# EAGLE design stm32_core_0_1 (EAGLE 5.10)
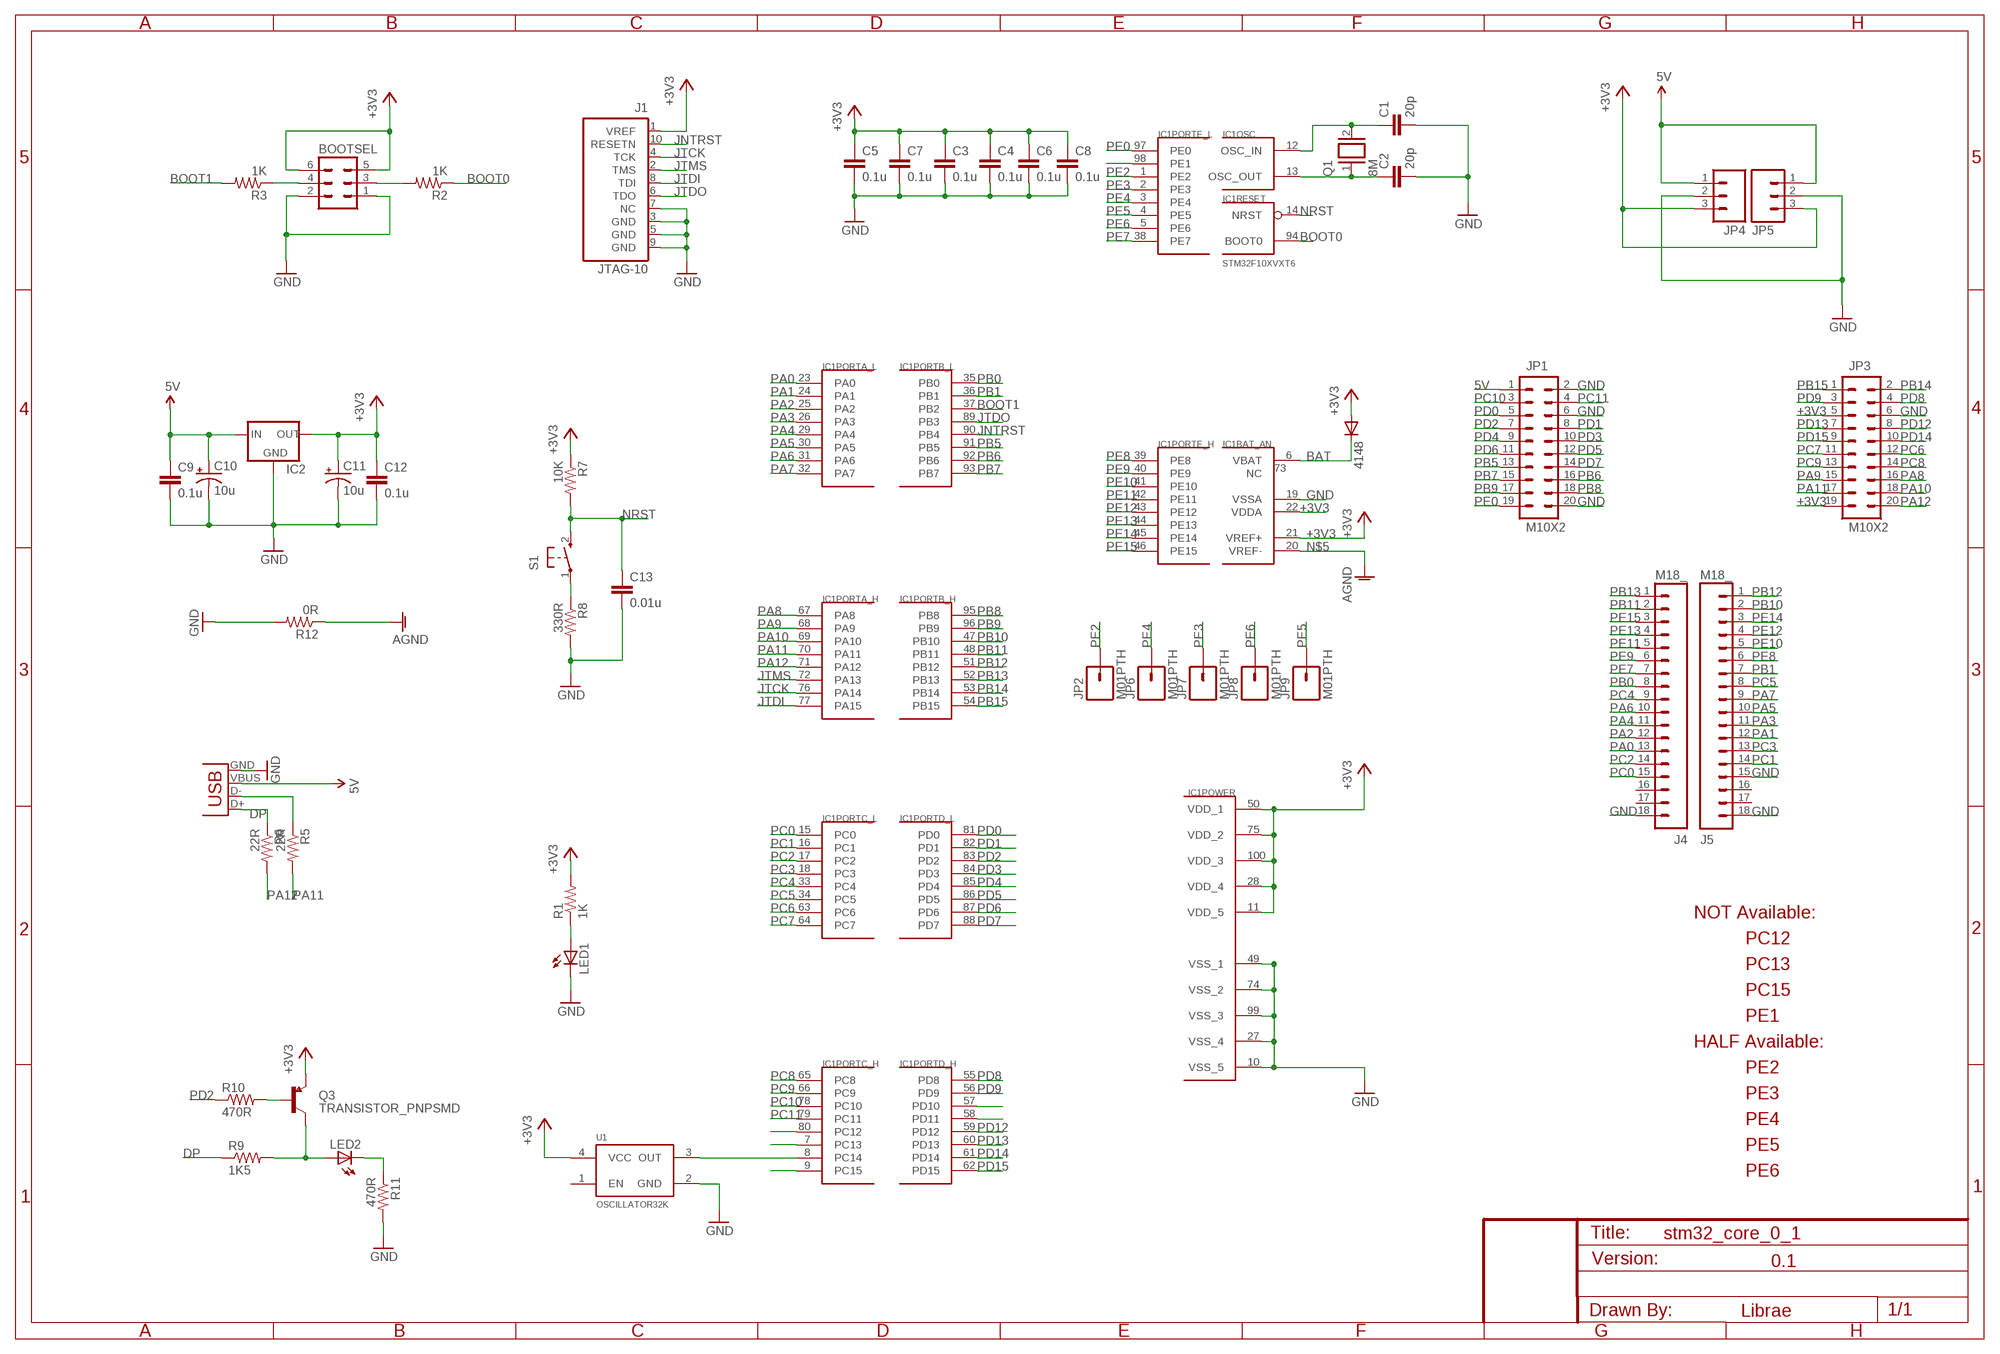
[diagram p0: schematic, sheet 1]

## Parts
4148  DIODESMA  [SMA-DIODE]
BOOTSEL  MA03-2  [MA03-2]
C1  20p  CAP0603-CAP  [0603-CAP]
C2  20p  CAP0603-CAP  [0603-CAP]
C3  0.1u  CAP0603-CAP  [0603-CAP]
C4  0.1u  CAP0603-CAP  [0603-CAP]
C5  0.1u  CAP0603-CAP  [0603-CAP]
C6  0.1u  CAP0603-CAP  [0603-CAP]
C7  0.1u  CAP0603-CAP  [0603-CAP]
C8  0.1u  CAP0603-CAP  [0603-CAP]
C9  0.1u  CAP0603-CAP  [0603-CAP]
C10  10u  CAP_POL3528  [EIA3528]
C11  10u  CAP_POL3528  [EIA3528]
C12  0.1u  CAP0603-CAP  [0603-CAP]
C13  0.01u  CAP0603-CAP  [0603-CAP]
IC1  STM32F10XVXT6  [TQFP100]
IC2  V_REG_LM1117SOT223  [SOT223]
J1  JTAG-10  [JTAG-10]
J4  M18_  [1X18]
J5  M18_  [1X18]
JP1  M10X2  [2X10]
JP2  M01PTH  [1X01]
JP3  M10X2  [2X10]
JP4  M03PTH  [1X03]
JP5  M03PTH  [1X03]
JP6  M01PTH  [1X01]
JP7  M01PTH  [1X01]
JP8  M01PTH  [1X01]
JP9  M01PTH  [1X01]
LED1  LED0603  [LED-0603]
LED2  LED0603  [LED-0603]
Q1  8M  XTAL/S  [QS]
Q3  TRANSISTOR_PNPSMD  [SOT23-3]
R1  1K  RESISTOR0603-RES  [0603-RES]
R2  1K  RESISTOR0603-RES  [0603-RES]
R3  1K  RESISTOR0603-RES  [0603-RES]
R5  22R  RESISTOR0603-RES  [0603-RES]
R6  22R  RESISTOR0603-RES  [0603-RES]
R7  10K  RESISTOR0603-RES  [0603-RES]
R8  330R  RESISTOR0603-RES  [0603-RES]
R9  1K5  RESISTOR0603-RES  [0603-RES]
R10  470R  RESISTOR0603-RES  [0603-RES]
R11  470R  RESISTOR0603-RES  [0603-RES]
R12  0R  RESISTOR0603-RES  [0603-RES]
S1  TAC_SWITCH  [TACTILE-PTH]
U1  OSCILLATOR32K  OSCILLATOR5X3  [CRYSTAL-SMD-5X3]
X2  USBSMD  [USB-MINIB]

## Nets
5V: C9.1 C10.A(+) IC2.3(IN) JP1.1 JP4.1 JP5.1 X2.VBUS
+3V3: 4148.A BOOTSEL.5 BOOTSEL.6 C3.1 C4.1 C5.1 C6.1 C7.1 C8.1 C11.A(+) C12.1 IC1.11(POWER:VDD_5) IC1.21(BAT_AN:VREF+) IC1.22(BAT_AN:VDDA) IC1.28(POWER:VDD_4) IC1.50(POWER:VDD_1) IC1.75(POWER:VDD_2) IC1.100(POWER:VDD_3) IC2.2(OUT) J1.1(VREF) JP3.5 JP3.19 JP4.3 JP5.3 Q3.2(E) R1.2 R7.1 U1.4(VCC)
BAT: 4148.C IC1.6(BAT_AN:VBAT)
BOOT0: IC1.94(RESET:BOOT0) R2.1
BOOT1: IC1.37(PORTB_L:PB2) R3.2
DP: R6.1 R9.1 X2.D+
GND: BOOTSEL.1 BOOTSEL.2 C1.2 C2.2 C3.2 C4.2 C5.2 C6.2 C7.2 C8.2 C9.2 C10.C(-) C11.C(-) C12.2 C13.2 IC1.10(POWER:VSS_5) IC1.19(BAT_AN:VSSA) IC1.27(POWER:VSS_4) IC1.49(POWER:VSS_1) IC1.74(POWER:VSS_2) IC1.99(POWER:VSS_3) IC2.1(ADJ) J1.3(GND) J1.5(GND) J1.7(NC) J1.9(GND) J4.18 J5.15 J5.18 JP1.2 JP1.6 JP1.20 JP3.6 JP4.2 JP5.2 LED1.C R8.2 R11.2 R12.2 U1.2(GND) X2.GND
JNTRST: IC1.90(PORTB_L:PB4) J1.10(RESETN)
JTCK: IC1.76(PORTA_H:PA14) J1.4(TCK)
JTDI: IC1.77(PORTA_H:PA15) J1.8(TDI)
JTDO: IC1.89(PORTB_L:PB3) J1.6(TDO)
JTMS: IC1.72(PORTA_H:PA13) J1.2(TMS)
N$1: C1.1 IC1.12(OSC:OSC_IN) Q1.2
N$2: IC1.57(PORTD_H:PD10)
N$3: C2.1 IC1.13(OSC:OSC_OUT) Q1.1
N$4: LED1.A R1.1
N$5: IC1.20(BAT_AN:VREF-) R12.1 ; supply symbol labelled AGND
N$6: BOOTSEL.4 R3.1
N$8: BOOTSEL.3 R2.2
N$9: R5.1 X2.D-
N$10: LED2.C R11.1
N$11: R8.1 S1.1
N$12: LED2.A Q3.3(C) R9.2
N$13: Q3.1(B) R10.2
N$14: IC1.7(PORTC_H:PC13)
N$15: IC1.8(PORTC_H:PC14) U1.3(OUT)
N$16: IC1.9(PORTC_H:PC15)
N$17: IC1.58(PORTD_H:PD11)
N$18: IC1.80(PORTC_H:PC12)
N$24: IC1.98(PORTE_L:PE1)
NRST: C13.1 IC1.14(RESET:NRST) R7.2 S1.2
PA0: IC1.23(PORTA_L:PA0) J4.13
PA1: IC1.24(PORTA_L:PA1) J5.12
PA2: IC1.25(PORTA_L:PA2) J4.12
PA3: IC1.26(PORTA_L:PA3) J5.11
PA4: IC1.29(PORTA_L:PA4) J4.11
PA5: IC1.30(PORTA_L:PA5) J5.10
PA6: IC1.31(PORTA_L:PA6) J4.10
PA7: IC1.32(PORTA_L:PA7) J5.9
PA8: IC1.67(PORTA_H:PA8) JP3.16
PA9: IC1.68(PORTA_H:PA9) JP3.15
PA10: IC1.69(PORTA_H:PA10) JP3.18
PA11: IC1.70(PORTA_H:PA11) JP3.17 R5.2
PA12: IC1.71(PORTA_H:PA12) JP3.20 R6.2
PB0: IC1.35(PORTB_L:PB0) J4.8
PB1: IC1.36(PORTB_L:PB1) J5.7
PB5: IC1.91(PORTB_L:PB5) JP1.13
PB6: IC1.92(PORTB_L:PB6) JP1.16
PB7: IC1.93(PORTB_L:PB7) JP1.15
PB8: IC1.95(PORTB_H:PB8) JP1.18
PB9: IC1.96(PORTB_H:PB9) JP1.17
PB10: IC1.47(PORTB_H:PB10) J5.2
PB11: IC1.48(PORTB_H:PB11) J4.2
PB12: IC1.51(PORTB_H:PB12) J5.1
PB13: IC1.52(PORTB_H:PB13) J4.1
PB14: IC1.53(PORTB_H:PB14) JP3.2
PB15: IC1.54(PORTB_H:PB15) JP3.1
PC0: IC1.15(PORTC_L:PC0) J4.15
PC1: IC1.16(PORTC_L:PC1) J5.14
PC2: IC1.17(PORTC_L:PC2) J4.14
PC3: IC1.18(PORTC_L:PC3) J5.13
PC4: IC1.33(PORTC_L:PC4) J4.9
PC5: IC1.34(PORTC_L:PC5) J5.8
PC6: IC1.63(PORTC_L:PC6) JP3.12
PC7: IC1.64(PORTC_L:PC7) JP3.11
PC8: IC1.65(PORTC_H:PC8) JP3.14
PC9: IC1.66(PORTC_H:PC9) JP3.13
PC10: IC1.78(PORTC_H:PC10) JP1.3
PC11: IC1.79(PORTC_H:PC11) JP1.4
PD0: IC1.81(PORTD_L:PD0) JP1.5
PD1: IC1.82(PORTD_L:PD1) JP1.8
PD2: IC1.83(PORTD_L:PD2) JP1.7 R10.1
PD3: IC1.84(PORTD_L:PD3) JP1.10
PD4: IC1.85(PORTD_L:PD4) JP1.9
PD5: IC1.86(PORTD_L:PD5) JP1.12
PD6: IC1.87(PORTD_L:PD6) JP1.11
PD7: IC1.88(PORTD_L:PD7) JP1.14
PD8: IC1.55(PORTD_H:PD8) JP3.4
PD9: IC1.56(PORTD_H:PD9) JP3.3
PD12: IC1.59(PORTD_H:PD12) JP3.8
PD13: IC1.60(PORTD_H:PD13) JP3.7
PD14: IC1.61(PORTD_H:PD14) JP3.10
PD15: IC1.62(PORTD_H:PD15) JP3.9
PE0: IC1.97(PORTE_L:PE0) JP1.19
PE2: IC1.1(PORTE_L:PE2) JP2.1
PE3: IC1.2(PORTE_L:PE3) JP7.1
PE4: IC1.3(PORTE_L:PE4) JP6.1
PE5: IC1.4(PORTE_L:PE5) JP9.1
PE6: IC1.5(PORTE_L:PE6) JP8.1
PE7: IC1.38(PORTE_L:PE7) J4.7
PE8: IC1.39(PORTE_H:PE8) J5.6
PE9: IC1.40(PORTE_H:PE9) J4.6
PE10: IC1.41(PORTE_H:PE10) J5.5
PE11: IC1.42(PORTE_H:PE11) J4.5
PE12: IC1.43(PORTE_H:PE12) J5.4
PE13: IC1.44(PORTE_H:PE13) J4.4
PE14: IC1.45(PORTE_H:PE14) J5.3
PE15: IC1.46(PORTE_H:PE15) J4.3
Unconnected: IC1.73(BAT_AN:NC) J4.16 J4.17 J5.16 J5.17 U1.1(EN)

## Notes on the sheet
- NOT Available:
- PC12
- PC13
- PC15
- PE1
- HALF Available:
- PE2
- PE3
- PE4
- PE5
- PE6
- 0.1

## Library data of the parts
4148 = MyLib:DIODE: Diode These are standard reverse protection diodes and small signal diodes. SMA package can handle up to about 1A. SOD-323 can handle about 200mA. What the SOD-323 package when ordering, there are some mfgs out there that are 5-pin packages.
BOOTSEL = con-lstb:MA03-2: PIN HEADER
C1-C9 C12 C13 = SparkFun:CAP: Capacitor Standard 0603 ceramic capacitor, and 0.1" leaded capacitor.
C10 C11 = SparkFun:CAP_POL: Capacitor Polarized These are standard SMD and PTH capacitors. Normally 10uF, 47uF, and 100uF in electrolytic and tantalum varieties. Always verify the external diameter of the through hole cap, it varies with capacity, voltage, and manufacturer. The EIA devices should be standard.
IC1 = stm32:STM32F10XVXT6: STM32F101/103 100 pin LQFP
IC2 = MyLib:V_REG_LM1117: Voltage Regulator LM1117 Standard adjustable voltage regulator but in SMD form. Spark Fun Electronics SKU : COM-00595
J1 = luminary-arm:JTAG-10: JTAG 10-Pin Programming/Debug Connector
J4 J5 = MyLib:M18
JP1 JP3 = MyLib:M10X2: This was SPECIALLY designed to be used with our Graphic LCD Backpack. Be sure you want to use this! It is not only staggered on each line of header holes, but IT IS ALSO offset of the center point of the top and bottom lines by 5 mil. This causes the headers to lock into place on the "standard" footprint on the LCD screen. The extra squares on the tdocu layer are there simply to reference other pins (if you were to actually populate a longer header than ten long - this is what we do with the backpacks).
JP2 JP6-JP9 = MyLib:M01: Header 1 Standard 1-pin 0.1" header. Use with straight break away headers (SKU : PRT-00116), right angle break away headers (PRT-00553), swiss pins (PRT-00743), machine pins (PRT-00117), and female headers (PRT-00115).
JP4 JP5 = MyLib:M03: Header 3 Standard 3-pin 0.1" header. Use with straight break away headers (SKU : PRT-00116), right angle break away headers (PRT-00553), swiss pins (PRT-00743), machine pins (PRT-00117), and female headers (PRT-00115). Molex polarized connector foot print use with SKU : PRT-08232 with associated crimp pins and housings.
LED1 LED2 = SparkFun:LED: LEDs Standard schematic elements and footprints for 5mm, 3mm, 1206, and 0603 sized LEDs. 5mm - Spark Fun Electronics SKU : COM-00529 (and others)
Q1 = special:XTAL/S: CRYSTAL
Q3 = SparkFun:TRANSISTOR_PNP
R1-R3 R5-R12 = SparkFun:RESISTOR: Resistor Basic schematic elements and footprints for 0603, 1206, and PTH 1/10th watt (small) resistors.
S1 = MyLib:TAC_SWITCH: Momentary Switch Button commonly used for reset or general input. Spark Fun Electronics SKU : COM-00097
U1 = SparkFun:OSCILLATOR
X2 = SparkFun:USB: USB Connectors USB-B-PTH is fully proven SKU : PRT-00139 USB-miniB is fully proven SKU : PRT-00587 USB-A-PCB is untested. USB-A-H is throughly reviewed, but untested. Spark Fun Electronics SKU : PRT-00437 USB-B-SMT is throughly reviewed, but untested. Needs silkscreen touching up. USB-A-S has not been used/tested USB-MB-H has not been used/tested

## Board
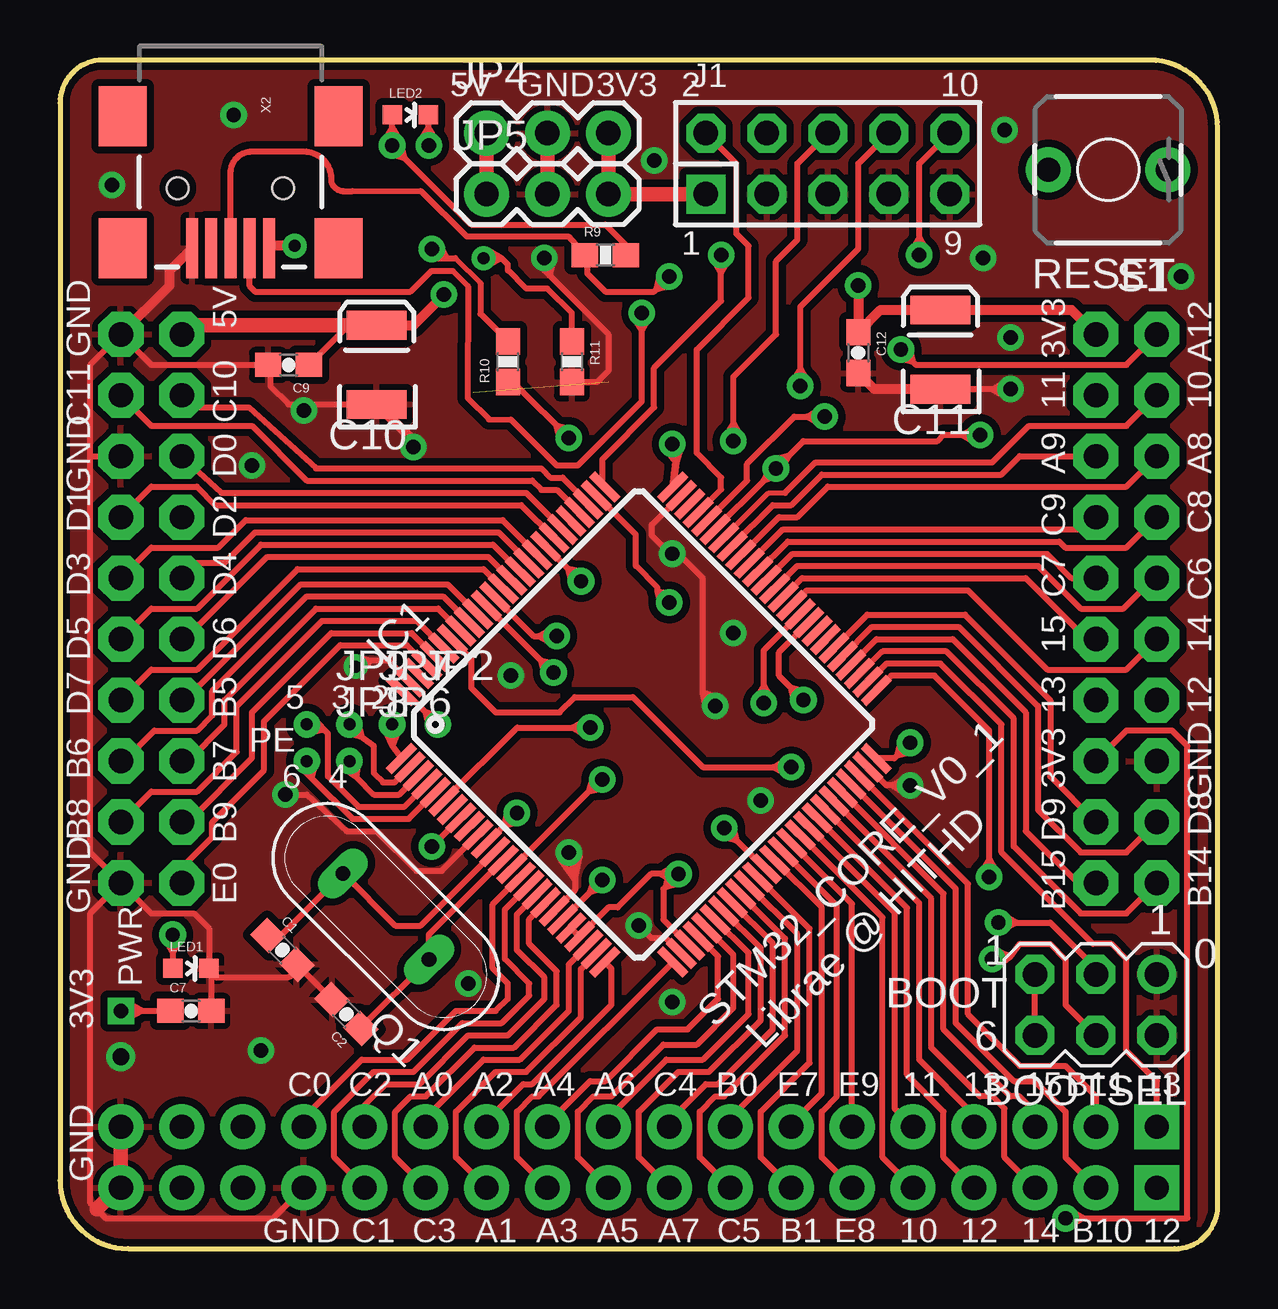
[diagram p1: board, top side]
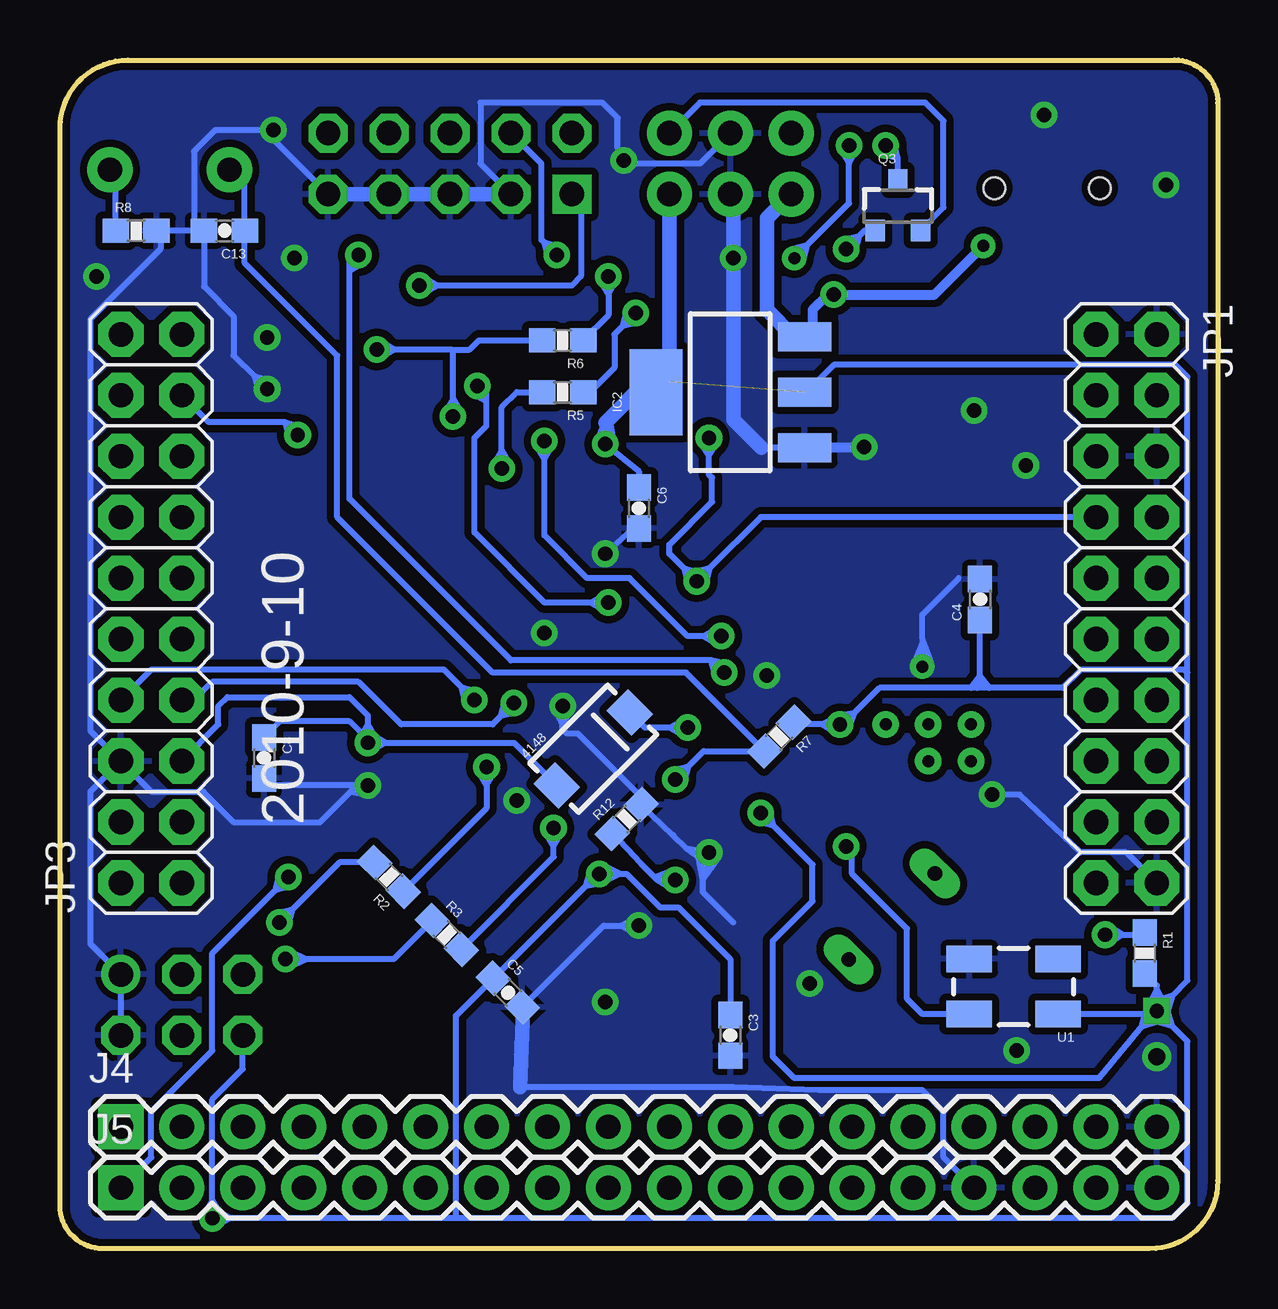
[diagram p2: board, bottom side, seen from below]

Size 48.26 x 49.53 mm. Coordinates in mm from the lower left corner, seen from the top.
Outline: 0,2.84 arc90 2.84,0 46.46,0 arc90 48.26,1.8 48.26,46.69 arc90 45.42,49.53 1.8,49.53 arc90 0,47.73 0,2.84
Copper layers (1*16): Top 0.035mm / dielectric 1.5mm / Bottom 0.035mm
Design rules "SparkFun": minimum track width 8mil, minimum drill 20mil, track to track 8mil, track to pad 8mil, pad to pad 8mil, via to via 8mil, smd to smd 8mil, copper to edge 10mil, drill to drill 8mil, minimum pad ring 12mil, minimum via ring 10mil, stop-mask expansion 4mil, vias tented up to drill 25mil, thermal gap 10mil

### Footprints (pad centres in the part's own frame; a part is rotated, then mirrored left to right if it is on the bottom)
SMA-DIODE = smd 1.27 x 1.47: A -2.15,0; C 2.15,0
MA03-2 = drill 1.016 round: 1 -2.54,-1.27 | drill 1.016 octagon: 2 -2.54,1.27; 3 0,-1.27; 4 0,1.27; 5 2.54,-1.27; 6 2.54,1.27
0603-CAP = smd 1.1 x 1: 1 -0.85,0; 2 0.85,0
EIA3528 = smd 1.2 x 2.5: A 1.65,0; C -1.65,0
TQFP100 = smd 1.5 x 0.35: 1 -8,6; 2 -8,5.5; 3 -8,5; 4 -8,4.5; 5 -8,4; 6 -8,3.5; 7 -8,3; 8 -8,2.5; 9 -8,2; 10 -8,1.5; 11 -8,1; 12 -8,0.5; 13 -8,0; 14 -8,-0.5; 15 -8,-1; 16 -8,-1.5; 17 -8,-2; 18 -8,-2.5; 19 -8,-3; 20 -8,-3.5; 21 -8,-4; 22 -8,-4.5; 23 -8,-5; 24 -8,-5.5; 25 -8,-6; 51 8,-6; 52 8,-5.5; 53 8,-5; 54 8,-4.5; 55 8,-4; 56 8,-3.5; 57 8,-3; 58 8,-2.5; 59 8,-2; 60 8,-1.5; 61 8,-1; 62 8,-0.5; 63 8,0; 64 8,0.5; 65 8,1; 66 8,1.5; 67 8,2; 68 8,2.5; 69 8,3; 70 8,3.5; 71 8,4; 72 8,4.5; 73 8,5; 74 8,5.5; 75 8,6 | smd 0.35 x 1.5: 26 -6,-8; 27 -5.5,-8; 28 -5,-8; 29 -4.5,-8; 30 -4,-8; 31 -3.5,-8; 32 -3,-8; 33 -2.5,-8; 34 -2,-8; 35 -1.5,-8; 36 -1,-8; 37 -0.5,-8; 38 0,-8; 39 0.5,-8; 40 1,-8; 41 1.5,-8; 42 2,-8; 43 2.5,-8; 44 3,-8; 45 3.5,-8; 46 4,-8; 47 4.5,-8; 48 5,-8; 49 5.5,-8; 50 6,-8; 76 6,8; 77 5.5,8; 78 5,8; 79 4.5,8; 80 4,8; 81 3.5,8; 82 3,8; 83 2.5,8; 84 2,8; 85 1.5,8; 86 1,8; 87 0.5,8; 88 0,8; 89 -0.5,8; 90 -1,8; 91 -1.5,8; 92 -2,8; 93 -2.5,8; 94 -3,8; 95 -3.5,8; 96 -4,8; 97 -4.5,8; 98 -5,8; 99 -5.5,8; 100 -6,8
SOT223 = smd 1.219 x 2.235: 1 -2.311,-3.099; 2 0,-3.099; 3 2.311,-3.099 | smd 3.6 x 2.2: 4 0,3.099
JTAG-10 = drill 1.016 square: 1 -5.08,-1.27 | drill 1.016 octagon: 2 -5.08,1.27; 3 -2.54,-1.27; 4 -2.54,1.27; 5 0,-1.27; 6 0,1.27; 7 2.54,-1.27; 8 2.54,1.27; 9 5.08,-1.27; 10 5.08,1.27
1X18 = drill 1.016 pad 1.88 square: 1 0,0 | drill 1.016 pad 1.88 round: 2 2.54,0; 3 5.08,0; 4 7.62,0; 5 10.16,0; 6 12.7,0; 7 15.24,0; 8 17.78,0; 9 20.32,0; 10 22.86,0; 11 25.4,0; 12 27.94,0; 13 30.48,0; 14 33.02,0; 15 35.56,0; 16 38.1,0; 17 40.64,0; 18 43.18,0
2X10 = drill 1.016 pad 1.88 octagon: 1 -11.43,-1.27; 2 -11.43,1.27; 3 -8.89,-1.27; 4 -8.89,1.27; 5 -6.35,-1.27; 6 -6.35,1.27; 7 -3.81,-1.27; 8 -3.81,1.27; 9 -1.27,-1.27; 10 -1.27,1.27; 11 1.27,-1.27; 12 1.27,1.27; 13 3.81,-1.27; 14 3.81,1.27; 15 6.35,-1.27; 16 6.35,1.27; 17 8.89,-1.27; 18 8.89,1.27; 19 11.43,-1.27; 20 11.43,1.27
1X01 = drill 0.5 pad 1.016 round: 1 0,0
1X03 = drill 1.016 pad 1.88 round: 1 0,0; 2 2.54,0; 3 5.08,0
LED-0603 = smd 0.8 x 0.8: A 0,-0.75; C 0,0.75
QS = drill 0.61 long: 1 -2.54,0; 2 2.54,0
SOT23-3 = smd 0.8 x 0.9: 1 -0.95,-1; 2 0.95,-1; 3 0,1.1
0603-RES = smd 1.1 x 1: 1 -0.85,0; 2 0.85,0
TACTILE-PTH = drill 1.016 pad 1.88 round: 1 -2.489,0; 2 2.489,0
CRYSTAL-SMD-5X3 = smd 1.9 x 1.1: 1 -1.85,-1.15; 2 1.85,-1.15; 3 1.85,1.15; 4 -1.85,1.15
USB-MINIB = smd 2.5 x 0.5: D+ 2.5,0; D- 2.5,0.8; GND 2.5,-1.6; ID 2.5,-0.8; VBUS 2.5,1.6 | smd 2.5 x 2: GND@1 -3,-4.5; GND@2 -3,4.5; GND@3 2.5,4.5; GND@4 2.5,-4.5 | hole 0.9: 0,2.2; 0,-2.2

### Placement (x,y rotation side)
4148  26.04,20.83 45 bottom
BOOTSEL  43.18,10.16 180 top
C1  9.27,12.45 315 top
C2  11.94,9.78 135 top
C3  20.32,8.89 270 bottom
C4  9.91,27.05 90 bottom
C5  29.59,10.67 315 bottom
C6  24.13,30.86 270 bottom
C7  5.46,9.91 0 top
C8  39.75,20.45 270 bottom
C9  9.53,36.83 180 top
C10  13.21,36.83 90 top
C11  36.7,37.47 90 top
C12  33.27,37.34 270 top
C13  41.4,42.42 180 bottom
IC1  24.13,21.84 45 top
IC2  20.32,35.69 90 bottom
J1  32,45.21 0 top
J4  45.72,5.08 0 bottom
J5  45.72,2.54 0 bottom
JP1  3.81,26.67 270 bottom
JP2  13.84,21.84 0 top
JP3  44.45,26.67 90 bottom
JP4  17.78,46.48 0 top
JP5  17.78,43.94 0 top
JP6  12.06,20.32 0 top
JP7  12.06,21.84 0 top
JP8  10.29,20.32 0 top
JP9  10.29,21.84 0 top
LED1  5.46,11.68 270 top
LED2  14.61,47.24 270 top
Q1  13.59,13.84 135 top
Q3  13.34,43.43 0 bottom
R1  3.05,12.32 270 bottom
R2  34.54,15.49 135 bottom
R3  32.13,13.08 315 bottom
R5  27.3,35.69 180 bottom
R6  27.3,37.85 180 bottom
R7  18.29,21.34 225 bottom
R8  45.09,42.42 0 bottom
R9  22.73,41.4 0 top
R10  18.67,36.96 90 top
R11  21.34,36.96 270 top
R12  24.64,17.91 45 bottom
S1  43.69,44.96 180 top
U1  8.51,10.92 180 bottom
X2  7.11,44.2 270 top

### Tracks (layer width: path | path; a pad name or v marks a point on that pad's centre or on a via)
5V  (via drill 0.5, 0.6)
  Top 0.254: C9.1 12.03,38.48 C10.A
  Top 0.406: C10.A 14.73,38.48 v16,39.75 | X2.VBUS 8.8,41.78 v9.78,41.78
  Top 0.61: JP5.1 JP4.1 | JP1.1 5.46,38.48 C10.A
  Bottom 0.254: 16.89,38.2 17.02,38.2 IC2.3 17.68,38
  Bottom 0.406: 16.89,38.2 16.89,39.12 16.26,39.75 v16,39.75 11.81,39.75 v9.78,41.78
  Bottom 0.61: JP5.1 18.8,42.93 18.8,39.12 17.68,38
+3V3  (via drill 0.6)  (1 unrouted)
  Top 0.254: v15.75,21.84 15.22,22.37 | 15.22,22.37 14.33,23.26 IC1.100 | IC1.50 34.78,20.43 34.9,20.55 | v35.43,21.08 34.9,20.55 | BOOTSEL.6 BOOTSEL.5 | JP3.5 44.45,21.59 46.35,21.59 46.99,20.95 46.99,1.27 42.66,1.27 | 26.67,12.32 26.67,12.19 26.25,12.61 IC1.28 26.21,12.65 25.15,13.72 25.15,14.99 25.25,15.09 | v25.78,15.62 25.25,15.09 | IC1.21 IC1.22 22.86,14.22 23.24,14.22 24.64,15.62 25.03,15.62 | v25.78,15.62 25.03,15.62 | IC1.11 17.78,16.89 18.52,17.63 | v19.05,18.16 18.52,17.63 | v2.54,9.91 3.44,9.91 | 3.44,9.91 C7.1 | v41.91,1.27 42.66,1.27 | 15.22,22.37 15.38,21.75 v15.75,21.84 | 15.22,22.37 15.84,22.21 v15.75,21.84 | 3.44,9.91 2.74,10.28 v2.54,9.91 | 3.44,9.91 2.74,9.53 v2.54,9.91 | 34.9,20.55 35.53,20.72 v35.43,21.08 | 34.9,20.55 35.07,21.18 v35.43,21.08 | 42.66,1.27 42.1,1.6 v41.91,1.27 | 42.66,1.27 42.1,0.94 v41.91,1.27 | 25.25,15.09 25.88,15.26 v25.78,15.62 | 25.25,15.09 25.42,15.72 v25.78,15.62 | 25.03,15.62 25.59,15.29 v25.78,15.62 | 25.03,15.62 25.59,15.95 v25.78,15.62 | 18.52,17.63 19.15,17.8 v19.05,18.16 | 18.52,17.63 18.68,18.26 v19.05,18.16
  Top 0.305: v25.53,33.53 25.67,33.38 25.67,32.79 | 25.67,32.79 IC1.75 | 25.67,32.79 25.86,33.43 v25.53,33.53 | 25.67,32.79 25.25,33.31 v25.53,33.53
  Top 0.406: JP3.19 42.16,39.12 C11.A 34.2,39.12 C12.1 v33.27,40.13
  Top 0.61: JP4.3 JP5.3 J1.1
  Bottom 0.254: Q3.2 11.43,43.39 11.43,46.99 12.19,47.75 21.59,47.75 JP4.3 | 25.4,34.79 25.53,34.42 v25.53,33.53 | R7.1 17.59,21.84 16.5,21.84 | 1.27,24 1.27,11.18 1.9,10.54 | 1.27,24 1.27,36.32 1.78,36.83 16,36.83 16.83,36.01 | v2.54,9.91 1.9,10.54 | v2.54,9.91 2.54,10.81 | 2.54,10.81 2.54,10.96 R1.2 | 4148.A 29.33,21.08 34.68,21.08 | v35.43,21.08 34.68,21.08 | 1.9,9.27 1.27,8.64 1.27,1.91 1.91,1.27 31.75,1.27 | 1.9,9.27 2.41,9.78 | 31.75,1.27 41.16,1.27 | 41.16,1.27 v41.91,1.27 | 31.75,1.27 31.75,9.71 C5.1 26.34,15.12 | 26.34,15.12 25.84,15.62 v25.78,15.62 | 18.52,17.63 16.89,16 16.89,14.48 18.54,12.83 18.54,8 17.65,7.11 4.95,7.11 4.46,7.7 3.18,9.27 | 18.52,17.63 v19.05,18.16 | v2.54,9.91 3.18,9.27 | 32.52,40.13 26.92,40.13 26.54,40.51 26.54,43.94 J1.1 | 32.52,40.13 v33.27,40.13 | 16.83,36.01 17.14,35.69 | BOOTSEL.6 40.64,7.49 41.91,6.22 41.91,2.02 | v41.91,1.27 41.91,2.02 | v15.75,21.84 16.5,21.84 | v15.75,21.84 15.62,21.84 15.16,22.31 | 15.16,22.31 14.1,23.37 10.29,23.37 | 9.53,23.37 6.48,23.37 5.71,24.13 1.4,24.13 1.27,24 | 9.53,23.37 10.03,23.37 | 10.03,23.37 10.29,23.37 | IC2.2 17.22,36.01 16.83,36.01 | 25.4,34.79 25.2,33.72 v25.53,33.53 | 25.4,34.79 25.85,33.72 v25.53,33.53 | 32.52,40.13 33.08,39.81 v33.27,40.13 | 32.52,40.13 33.08,40.46 v33.27,40.13 | 16.5,21.84 15.94,22.17 v15.75,21.84 | 16.5,21.84 15.94,21.52 v15.75,21.84 | 15.16,22.31 15.4,21.7 v15.75,21.84 | 15.16,22.31 15.8,22.22 v15.75,21.84 | 1.9,10.54 2.13,9.78 v2.54,9.91 | 1.9,10.54 2.66,10.31 v2.54,9.91 | 2.54,10.81 2.16,10.11 v2.54,9.91 | 2.54,10.81 2.92,10.11 v2.54,9.91 | 1.9,9.27 2.66,9.5 v2.54,9.91 | 1.9,9.27 2.13,10.03 v2.54,9.91 | 3.18,9.27 2.95,10.03 v2.54,9.91
  Bottom 0.254: 3.18,9.27 2.42,9.5 v2.54,9.91 | 34.68,21.08 35.24,20.76 v35.43,21.08 | 34.68,21.08 35.24,21.41 v35.43,21.08 | 41.16,1.27 41.72,0.94 v41.91,1.27 | 41.16,1.27 41.72,1.6 v41.91,1.27 | 41.91,2.02 41.58,1.46 v41.91,1.27 | 41.91,2.02 42.24,1.46 v41.91,1.27 | 26.34,15.12 26.14,15.74 v25.78,15.62 | 26.34,15.12 25.7,15.25 v25.78,15.62 | 18.52,17.63 19.15,17.8 v19.05,18.16 | 18.52,17.63 18.68,18.26 v19.05,18.16 | C3.1 20.32,12.06 22.48,14.22 23.24,14.22 24.64,15.62 24.89,15.62 | v25.78,15.62 24.89,15.62 | 24.89,15.62 25.65,16 v25.78,15.62 | v25.78,15.62 25.65,15.24 24.89,15.62 | 9.91,23.88 9.91,23.5 10.03,23.37 | 9.91,23.88 C4.1 | 9.53,23.37 9.91,23.88 | 9.91,23.88 10.29,23.37 | C6.1 24.13,32.38 v25.53,33.53 | JP3.5 41.66,21.84 41.66,22.61 41.27,22.99 36.2,22.99 35.43,22.23 35.43,21.84 | 35.43,21.84 v35.43,21.08 | 35.43,21.84 35.05,21.21 v35.43,21.08 | v35.43,21.08 35.81,21.21 35.43,21.84 | C8.1 39.08,21.97 36.2,21.97 35.43,21.21 v35.43,21.08 | U1.4 2.54,9.77 v2.54,9.91 | 22.86,36.12 23.82,36.12
  Bottom 0.61: JP5.3 22.86,36.12 | v25.53,33.53 25.45,33.53 | 23.82,36.12 25.53,34.42 | 2.41,9.78 v2.54,9.91
BAT  (via drill 0.6)
  Top 0.254: 21.35,21.72 v22.1,21.72 | 21.35,21.72 21.91,21.39 v22.1,21.72 | 21.35,21.72 21.91,22.04 v22.1,21.72 | IC1.6 19.05,21.72 21.35,21.72
  Bottom 0.254: 24.39,22.23 4148.C 23.88,21.72 22.85,21.72 | v22.1,21.72 22.85,21.72 | 22.85,21.72 22.29,22.04 v22.1,21.72 | 22.85,21.72 22.29,21.39 v22.1,21.72
BOOT0  (via drill 0.6)
  Top 0.254: 29.73,20.07 26.8,20.07 23.88,22.99 21.46,22.99 20.83,22.35 18.16,22.35 17.14,23.37 17.14,24.59 IC1.94 | 29.73,20.07 v30.48,20.07 | 29.73,20.07 30.29,19.74 v30.48,20.07 | 29.73,20.07 30.29,20.39 v30.48,20.07
  Bottom 0.254: v30.48,20.07 30.48,19.32 | 30.48,19.32 30.48,18.36 R2.1 | 30.48,19.32 30.81,19.88 v30.48,20.07 | 30.48,19.32 30.15,19.88 v30.48,20.07
BOOT1  (via drill 0.6)
  Top 0.254: v27.69,17.53 28.22,17 | 28.22,17 29.38,15.83 IC1.37 | 28.22,17 28.05,17.62 v27.69,17.53 | 28.22,17 27.59,17.16 v27.69,17.53
  Bottom 0.254: R3.2 27.69,16.32 27.69,16.78 | 27.69,16.78 v27.69,17.53 | 27.69,16.78 28.01,17.34 v27.69,17.53 | 27.69,16.78 27.36,17.34 v27.69,17.53
DP  (via drill 0.6)
  Top 0.254: X2.D+ 7.11,44.83 arc-90 8,45.72 10.16,45.72 arc-90 11.3,44.58 arc90 11.81,44.07 12.19,44.07 15.02,44.08 16.95,42.18 21.2,42.18 R9.1 21.97,41.31 21.97,40.64 22.73,39.88 24.77,39.88 24.87,39.98 | 24.87,39.98 v25.4,40.51 | 24.87,39.98 25.5,40.15 v25.4,40.51 | 24.87,39.98 25.04,40.61 v25.4,40.51
  Bottom 0.254: v25.4,40.51 25.4,39.76 | 25.4,39.76 25.73,40.32 v25.4,40.51 | 25.4,39.76 25.07,40.32 v25.4,40.51 | R6.1 25.4,38.9 25.4,39.76
GND  (via drill 0.5, 0.6, 0.7)
  Top 0.254: C10.C 9.52,35.18 8.76,35.94 8.76,36.74 C9.2 3.81,36.83 JP1.2 1.27,36.83 1.27,33.02 | R11.2 22.39,36.11 22.86,36.58 22.86,38.1 20.41,40.55 | 20.41,40.55 20.19,40.77 v20.19,41.27 | v39.62,35.81 38.87,35.81 | 38.87,35.81 C11.C | LED1.C 6.21,13.35 5.59,13.97 3.81,13.97 JP1.20 | LED1.C arc90 6.59,11.3 9.4,11.3 arc90 9.87,11.78 C1.2 C2.2 | JP1.20 1.27,13.97 1.27,1.91 1.52,1.65 1.91,1.27 8.89,1.27 J5.15 | IC1.49 34.45,19.3 34.68,19.3 | v35.43,19.3 34.68,19.3 | C7.2 6.31,11.58 LED1.C | JP1.20 1.27,16.51 1.27,33.02 | 1.27,33.02 JP1.6 | v21.21,16.51 21.46,15.38 | 21.46,15.38 21.46,14.93 IC1.19 | 26.8,23.16 26.8,23.11 v27.3,22.61 | 26.8,23.16 26.8,27.94 25.78,28.96 v25.53,28.96 25.44,28.96 24.68,29.71 24.68,30.17 IC1.74 | 20.41,40.55 20.56,41.19 v20.19,41.27 | 20.41,40.55 19.93,41 v20.19,41.27 | 38.87,35.81 39.43,35.49 v39.62,35.81 | 38.87,35.81 39.43,36.14 v39.62,35.81 | 34.68,19.3 35.24,18.98 v35.43,19.3 | 34.68,19.3 35.24,19.63 v35.43,19.3 | 21.46,15.38 21.66,16.32 v21.21,16.51 | 21.46,15.38 20.88,16.19 v21.21,16.51 | 26.8,23.16 26.94,22.52 v27.3,22.61 | 26.8,23.16 27.42,22.97 v27.3,22.61 | IC1.27 25.24,12.95 24.64,12.95 v24.13,13.46 | v9.4,18.92 10.29,18.92 11.94,17.4 13.21,17.4 14.86,15.75 15.91,15.75 IC1.10 | IC1.99 13.69,24.51 12.95,24.51 | 12.95,24.51 12.57,24.51 v12.32,24.26 | 12.95,24.51 12.32,24.64 v12.32,24.26 | 12.95,24.51 12.57,24 v12.32,24.26
  Top 0.406: C12.2 33.95,35.81 C11.C | C10.C 14.73,33.66 v14.73,33.4 | X2.GND 4.57,40.76 4.57,40.13 JP1.2
  Top 0.61: JP5.2 JP4.2 | 1.52,1.65 2.41,2.54 J5.18 J4.18
  Bottom 0.254: C13.2 44.07,42.42 | 44.07,42.42 R8.2 | J1.9 39.75,46.61 41.78,46.61 42.67,45.72 42.67,42.84 C13.2 | C13.2 42.25,40.09 41.02,38.86 41.02,37.21 40.15,36.34 | 40.15,36.34 v39.62,35.81 | J1.3 30.73,45.21 30.73,47.75 25.65,47.75 25.02,47.12 25.02,45.85 24.38,45.21 21.59,45.21 JP4.2 | v35.43,19.3 35.69,19.05 36.14,19.05 | BOOTSEL.2 BOOTSEL.1 46.99,12.7 46.99,19.05 JP3.6 | 29.08,10.16 C5.2 25.59,13.46 24.88,13.46 | 29.08,10.16 | IC2.1 19.02,33.38 | v14.73,33.4 14.76,33.38 | v12.32,24.26 12.3,25.3 | JP1.20 3.81,16.51 5.71,16.51 8.26,18.92 v9.4,18.92 | v21.21,16.51 22.12,16.66 | 22.12,16.66 22.7,17.24 R12.2 24.04,18.83 26.67,21.46 27.12,21.46 27.3,21.65 27.3,21.86 | 21.46,15.38 21.46,14.86 20.19,13.59 | 21.46,15.38 v21.21,16.51 | J5.15 11.43,3.81 11.43,5.71 12.32,6.6 16.64,6.6 20.19,6.73 29.08,6.73 | 27.3,21.86 v27.3,22.61 | JP3.6 46.99,21.59 46.99,38.73 44.07,41.66 44.07,42.42 | 24.88,13.46 v24.13,13.46 | 40.15,36.34 39.53,36.18 v39.62,35.81 | 40.15,36.34 39.99,35.72 v39.62,35.81 | 36.14,19.05 35.72,19.55 v35.43,19.3 | 36.14,19.05 35.5,18.93 v35.43,19.3 | 12.3,25.3 11.95,24.41 v12.32,24.26 | 12.3,25.3 12.67,24.37 v12.32,24.26 | 22.12,16.66 21.49,16.49 v21.21,16.51 | 22.12,16.66 21.45,16.16 v21.21,16.51 | 21.46,15.38 21.66,16.45 v21.21,16.51 | 21.46,15.38 20.88,16.19 v21.21,16.51 | 24.88,13.46 24.32,13.79 v24.13,13.46 | 24.88,13.46 24.32,13.14 v24.13,13.46 | 27.3,21.86 27.63,22.42 v27.3,22.61 | 27.3,21.86 26.98,22.42 v27.3,22.61 | 10.79,27.94 12.32,26.42 12.32,25.53 12.3,25.3 | 36.14,19.05 37.41,17.78 41.02,17.78 42.29,19.05 44.45,19.05 JP3.6 | C8.2 39.46,19.3 v35.43,19.3 | v25.53,28.96 24.34,30.01 C6.2
  Bottom 0.406: 14.76,33.38 IC2.1
  Bottom 0.61: JP5.2 20.19,43.81 v20.19,41.27 20.19,34.54 19.02,33.38 | J1.9 J1.7 J1.5 J1.3 | 29.08,6.73 28.96,10.03 C5.2
  other vias: 28.07,25.65 2.54,8 7.24,47.24 2.16,44.32 46.74,40.51 38.48,41.27 25.53,10.29 17.02,11.05 8.38,8.26 8,32.64 10.16,34.92 24.77,45.34 39.37,46.61 39.62,37.97 18.8,23.88 29.21,18.67
  pour Top (isolate 0.305): 0,2.54 arc90 2.54,0 45.72,0 arc90 48.26,2.54 48.26,46.99 arc90 45.72,49.53 2.54,49.53 arc90 0,46.99
  pour Bottom (isolate 0.305): 0,46.99 arc-90 2.54,49.53 45.72,49.53 arc-90 48.26,46.99 48.26,2.54 arc-90 45.72,0 2.54,0 arc-90 0,2.54
JNTRST  (via drill 0.6)
  Top 0.254: J1.10 35.81,45.21 35.81,42.15 | v35.81,41.4 35.81,42.15 | v20.57,24 20.56,24 20.04,24.52 | IC1.90 20.04,24.52 | 35.81,42.15 35.49,41.59 v35.81,41.4 | 35.81,42.15 36.14,41.59 v35.81,41.4 | 20.04,24.52 20.21,23.9 v20.57,24 | 20.04,24.52 20.66,24.37 v20.57,24
  Bottom 0.254: v35.81,41.4 36.2,41.02 36.2,40.76 | 36.2,40.76 36.2,31.24 29.46,24.51 21.13,24.51 | 21.13,24.51 21.08,24.51 v20.57,24 | 36.2,40.76 36.19,41.4 v35.81,41.4 | 36.2,40.76 35.63,41.07 v35.81,41.4 | 21.13,24.51 20.49,24.37 v20.57,24 | 21.13,24.51 20.93,23.89 v20.57,24
JTCK  (via drill 0.6)
  Top 0.254: IC1.76 22.61,31.85 22.61,32.89 24.77,35.05 24.77,36.7 27.56,39.5 27.56,40.65 | 27.56,40.65 v27.56,41.4 | 27.56,40.65 27.89,41.21 v27.56,41.4 | 27.56,40.65 27.23,41.21 v27.56,41.4
  Bottom 0.254: v27.56,41.4 28.09,41.93 | 28.09,41.93 28.19,42.04 28.19,45.21 J1.4 | 28.09,41.93 27.46,41.77 v27.56,41.4 | 28.09,41.93 27.92,41.31 v27.56,41.4
JTDI  (via drill 0.6)
  Top 0.254: J1.8 33.27,45.21 33.27,41.66 30.86,39.24 30.86,36.69 | v30.86,35.94 30.86,36.69 | 24.89,27.42 v25.4,26.92 | 30.86,36.69 30.54,36.13 v30.86,35.94 | 30.86,36.69 31.19,36.13 v30.86,35.94 | 24.89,27.42 25.07,26.73 v25.4,26.92 | 24.89,27.42 25.6,27.24 v25.4,26.92 | IC1.77 24,29.75 24,28.45 24.89,27.56 24.89,27.42
  Bottom 0.254: v25.4,26.92 26.15,26.92 | 26.15,26.92 28.07,26.92 30.99,29.84 30.99,33.78 30.48,34.29 30.48,35.3 | 30.48,35.3 30.48,35.56 v30.86,35.94 | 30.48,35.3 31.05,35.61 v30.86,35.94 | 30.48,35.3 30.48,35.94 v30.86,35.94 | 26.15,26.92 25.59,27.25 v25.4,26.92 | 26.15,26.92 25.59,26.6 v25.4,26.92
JTDO  (via drill 0.6)
  Top 0.254: J1.6 30.73,45.21 30.73,42.04 29.84,41.15 29.84,38.1 28.07,36.32 28.07,34.41 | v28.07,33.66 28.07,34.41 | IC1.89 19.74,25.53 19.95,25.53 | 19.95,25.53 v20.7,25.53 | 28.07,34.41 27.74,33.84 v28.07,33.66 | 28.07,34.41 28.39,33.84 v28.07,33.66 | 19.95,25.53 20.51,25.2 v20.7,25.53 | 19.95,25.53 20.51,25.85 v20.7,25.53
  Bottom 0.254: v20.7,25.53 21.45,25.53 | 21.45,25.53 22.1,25.53 24.51,27.94 26.29,27.94 28.07,29.72 28.07,32.91 | 28.07,32.91 v28.07,33.66 | 28.07,32.91 28.39,33.47 v28.07,33.66 | 28.07,32.91 27.74,33.47 v28.07,33.66 | 21.45,25.53 20.89,25.85 v20.7,25.53 | 21.45,25.53 20.89,25.2 v20.7,25.53
JTMS
  Top 0.254: J1.2 28.19,45.21 28.19,42.29 28.7,41.78 28.7,39.62 26.54,37.47 26.54,33.15 27.56,32.13 27.56,31.64 IC1.72
N$1
  Top 0.254: C1.1 9.2,13.05 Q1.2 | IC1.12 15.04,13.46 13.97,13.46 Q1.2 | Q1.2
N$3
  Top 0.254: C2.1 12.54,9.2 Q1.1 15.38,13.1 IC1.13
N$4  (via drill 0.6)
  Top 0.254: LED1.A 4.71,12.33 | 4.71,12.33 4.71,13.07 v4.7,13.08 | 4.71,12.33 5.03,12.9 v4.7,13.08 | 4.71,12.33 4.38,12.89 v4.7,13.08
  Bottom 0.254: v4.7,13.08 3.95,13.08 | 3.95,13.08 3.14,13.08 R1.1 | 3.95,13.08 4.51,12.76 v4.7,13.08 | 3.95,13.08 4.51,13.41 v4.7,13.08
N$5  (via drill 0.6)
  Top 0.254: IC1.20 22.09,14.86 22.35,15.49 v22.61,15.37 | v22.61,15.37 22.86,15.11 22.11,14.86 22.11,14.87 v22.61,15.37
  Bottom 0.254: 23.37,15.49 22.73,15.75 v22.61,15.37 | R12.1 24.04,16.04 23.37,15.37 | v22.61,15.37 23.37,15.37 | 23.37,15.37 22.73,14.99 v22.61,15.37
N$6  (via drill 0.6)
  Top 0.254: BOOTSEL.4 41.91,10.16 41.91,12.06 41.27,12.7 40.01,12.7 39.6,12.17 | v38.86,12.06 39.6,12.17 | 39.6,12.17 39,12.41 v38.86,12.06 | 39.6,12.17 39.1,11.77 v38.86,12.06
  Bottom 0.254: 37.98,12.06 34.35,12.06 R3.1 | 37.98,12.06 v38.86,12.06 | 37.98,12.06 38.67,11.74 v38.86,12.06 | 37.98,12.06 38.67,12.39 v38.86,12.06
N$8  (via drill 0.6)
  Top 0.254: v39.12,13.59 39.87,13.59 | 39.87,13.59 41.27,13.59 43.18,11.68 BOOTSEL.3 | 39.87,13.59 39.31,13.91 v39.12,13.59 | 39.87,13.59 39.31,13.26 v39.12,13.59
  Bottom 0.254: 38.59,14.12 v39.12,13.59 | 38.59,14.12 38.75,13.49 v39.12,13.59 | 38.59,14.12 39.21,13.95 v39.12,13.59 | 38.59,14.12 36.61,16.09 R2.2
N$9  (via drill 0.6)
  Top 0.203: 16.37,40.74 17,40.11
  Top 0.254: X2.D- 7.91,40.09 8.13,39.88 14.61,39.88 15.49,40.74 16.37,40.74 | 17,40.11 16.99,35.45 17.88,34.56 18.8,34.54 20.7,32.64 21.59,32.64 24.26,35.31 24.26,38.24 | 24.26,38.24 v24.26,38.99 | 24.26,38.24 24.58,38.8 v24.26,38.99 | 24.26,38.24 23.93,38.8 v24.26,38.99
  Bottom 0.254: R5.1 26.16,35.69 25.15,36.7 25.15,38.1 24.79,38.46 | v24.26,38.99 24.79,38.46 | 24.79,38.46 24.62,39.09 v24.26,38.99 | 24.79,38.46 24.16,38.62 v24.26,38.99
N$10  (via drill 0.5, 0.6)
  Top 0.254: 15.36,46.72 15.36,45.99 v15.37,45.97 | 15.36,46.72 LED2.C | 18.4,41.27 v17.65,41.27 | 15.36,46.72 15.04,46.16 v15.37,45.97 | 15.36,46.72 15.69,46.17 v15.37,45.97 | 18.4,41.27 17.84,41.6 v17.65,41.27 | 18.4,41.27 17.84,40.95 v17.65,41.27 | R11.1 21.34,38.99 20.32,40.01 19.43,40.01 18.67,40.77 18.67,41.01 18.4,41.27
  Bottom 0.254: 15.37,45.22 15.37,43.56 17.12,41.8 | 15.37,45.22 v15.37,45.97 | v17.65,41.27 17.12,41.8 | 15.37,45.22 15.69,45.78 v15.37,45.97 | 15.37,45.22 15.04,45.78 v15.37,45.97 | 17.12,41.8 17.29,41.18 v17.65,41.27 | 17.12,41.8 17.75,41.64 v17.65,41.27
N$11
  Bottom 0.254: R8.1 45.94,44.56 S1.1
N$12  (via drill 0.6)
  Top 0.254: v13.84,45.97 13.84,46.72 | 13.84,46.72 13.84,47.23 LED2.A | v13.84,45.97 14.37,45.44 | 14.37,45.44 17.14,42.67 22.73,42.67 23.58,41.82 R9.2 | 13.84,46.72 13.52,46.16 v13.84,45.97 | 13.84,46.72 14.17,46.16 v13.84,45.97 | 14.37,45.44 14.21,46.07 v13.84,45.97 | 14.37,45.44 13.75,45.61 v13.84,45.97
  Bottom 0.254: Q3.3 13.34,45.42 | 13.34,45.42 13.34,45.47 v13.84,45.97 | 13.34,45.42 13.95,45.61 v13.84,45.97 | 13.34,45.42 13.47,46.05 v13.84,45.97
N$13  (via drill 0.6)
  Top 0.203: 16.48,41.27 17.53,40.25
  Top 0.254: v15.49,41.66 15.75,41.53 16,41.27 16.14,41.27 | 16.14,41.27 16.48,41.27 | 17.53,40.25 17.53,38.95 R10.2 | 16.14,41.27 15.82,41.84 v15.49,41.66 | 16.14,41.27 15.49,41.28 v15.49,41.66
  Bottom 0.254: Q3.1 14.72,42.43 14.96,42.19 | 14.96,42.19 v15.49,41.66 | 14.96,42.19 15.13,41.56 v15.49,41.66 | 14.96,42.19 15.59,42.02 v15.49,41.66
N$15  (via drill 0.6)
  Top 0.254: v15.49,16.76 15.51,16.76 IC1.8
  Bottom 0.254: U1.3 12.31,9.77 12.95,10.41 12.95,13.34 15.24,15.62 15.24,16.51 v15.49,16.76
NRST  (via drill 0.6)
  Top 0.254: v22.61,19.56 22.55,19.56 22.05,19.06 | IC1.14 22.05,19.06 | 22.05,19.06 22.68,19.19 v22.61,19.56 | 22.05,19.06 22.25,19.67 v22.61,19.56
  Bottom 0.254: v22.61,19.56 22.08,20.09 | 22.08,20.09 21.43,20.73 R7.2 22.16,24 30.23,24 36.7,30.48 36.7,37.21 40.55,41.06 C13.1 40.56,42.43 40.56,44.32 S1.2 | 22.08,20.09 22.24,19.46 v22.61,19.56 | 22.08,20.09 22.7,19.92 v22.61,19.56
PA0
  Top 0.254: IC1.23 21.21,11.85 21.21,9.91 19.18,7.87 17.65,7.87 15.24,5.46 J4.13
PA1
  Top 0.254: IC1.24 21.72,11.65 21.72,9.65 19.43,7.37 18.16,7.37 16.51,5.71 16.51,3.81 J5.12
PA2
  Top 0.254: IC1.25 22.99,11.67 22.99,10.16 19.68,6.86 19.3,6.86 17.78,5.33 J4.12
PA3
  Top 0.254: IC1.26 19.95,6.35 19.68,6.35 19.05,5.71 19.05,3.81 J5.11
PA4
  Top 0.254: J4.11 20.32,5.21 22.1,6.99 22.73,6.99 24.89,9.14 26.16,9.14 27.43,10.41 27.43,12.18 IC1.29
PA5
  Top 0.254: J5.10 21.59,3.81 21.59,5.71 22.23,6.35 22.99,6.35 25.15,8.51 26.54,8.51 28.07,10.03 28.07,12.25 IC1.30
PA6
  Top 0.254: IC1.31 28.7,12.32 28.7,9.78 26.8,7.87 25.27,7.87 22.86,5.46 J4.10
PA7
  Top 0.254: IC1.32 29.21,12.52 29.21,9.53 27.05,7.37 25.78,7.37 24.13,5.71 24.13,3.81 J5.9
PA8
  Top 0.254: JP3.16 44.45,31.75 32,31.75 30.73,30.48 29.97,30.48 28.41,28.91 IC1.67
PA9
  Top 0.254: JP3.15 40.01,33.02 39.24,32.26 31.75,32.26 30.48,30.99 29.72,30.99 28.02,29.29 IC1.68
PA10
  Top 0.203: 30.23,31.5 29.54,31.5 IC1.69
  Top 0.254: 30.23,31.5 31.5,32.77 38.86,32.77 40.39,34.29 44.45,34.29 JP3.18
PA11  (via drill 0.6)
  Top 0.254: 37.6,33.91 v38.35,33.91 | v29.84,32.51 30.38,33.04 | 30.38,33.04 30.99,33.66 36.58,33.66 36.83,33.91 37.6,33.91 | 29.32,31.98 IC1.70 | 29.32,31.98 v29.84,32.51 | 30.38,33.04 29.75,32.88 v29.84,32.51 | 30.38,33.04 30.08,32.54 v29.84,32.51 | 29.32,31.98 29.94,32.27 v29.84,32.51 | 29.32,31.98 29.61,32.61 v29.84,32.51 | 37.6,33.91 38.16,33.58 v38.35,33.91 | 37.6,33.91 38.16,34.23 v38.35,33.91
  Bottom 0.254: v38.35,33.91 38.88,34.44 | v29.84,32.51 29.84,33.26 | 29.84,33.26 29.52,32.7 v29.84,32.51 | 29.84,33.26 30.17,32.7 v29.84,32.51 | 38.88,34.44 38.26,34.27 v38.35,33.91 | 38.88,34.44 38.72,33.81 v38.35,33.91 | R5.2 29.21,35.69 29.84,35.05 29.84,33.26 | 38.88,34.44 42.06,34.44 JP3.17
PA12  (via drill 0.6)
  Top 0.254: JP3.20 44.45,36.83 35.69,36.83 35.58,36.94 | v35.05,37.47 35.58,36.94 | 31.13,34.67 v31.88,34.67 | IC1.71 28.64,32 28.64,32.7 30.61,34.67 31.13,34.67 | 35.58,36.94 35.42,37.56 v35.05,37.47 | 35.58,36.94 34.96,37.1 v35.05,37.47 | 31.13,34.67 31.69,34.34 v31.88,34.67 | 31.13,34.67 31.69,35 v31.88,34.67
  Bottom 0.254: 31.94,37.47 34.3,37.47 | 34.3,37.47 v35.05,37.47 | R6.2 30.8,37.85 31.18,37.47 31.94,37.47 | v31.88,34.67 31.88,35.42 | 31.88,35.42 31.88,37.4 31.94,37.47 | 34.3,37.47 34.86,37.14 v35.05,37.47 | 34.3,37.47 34.86,37.79 v35.05,37.47 | 31.88,35.42 31.55,34.86 v31.88,34.67 | 31.88,35.42 32.2,34.86 v31.88,34.67
PB0
  Top 0.254: IC1.35 30.73,13.12 30.73,8.26 27.94,5.46 J4.8
PB1
  Top 0.254: J5.7 29.21,3.81 29.21,5.71 31.24,7.75 31.24,13.34 29.1,15.48 IC1.36
PB5
  Top 0.254: IC1.91 16.17,27.69 10.03,27.69 5.21,22.86 JP1.13
PB6
  Top 0.254: IC1.92 15.97,27.18 10.29,27.18 6.35,23.24 6.35,22.23 5.71,21.59 3.94,21.59 2.67,20.32 JP1.16
PB7
  Top 0.254: IC1.93 15.77,26.67 10.67,26.67 6.86,22.86 6.86,21.84 5.33,20.32 JP1.15
PB8
  Top 0.254: IC1.95 14.86,26.16 10.92,26.16 7.37,22.61 7.37,20.7 5.71,19.05 3.81,19.05 JP1.18
PB9
  Top 0.254: JP1.17 5.33,17.78 8,20.45 8,22.35 11.3,25.65 14.66,25.65 IC1.96
PB10
  Top 0.254: IC1.47 37.34,15 37.34,9.4 39.75,6.99 40.64,6.99 41.91,5.71 41.91,3.81 J5.2
PB11
  Top 0.254: IC1.48 37.85,15.2 37.85,9.78 40.01,7.62 41.91,7.62 43.18,6.35 J4.2
PB12  (via drill 0.6)
  Top 0.254: IC1.51 34.65,23.88 36.45,23.88 38.73,21.59 38.73,16.24 | v38.73,15.49 38.73,16.24 | 38.73,16.24 38.41,15.68 v38.73,15.49 | 38.73,16.24 39.06,15.68 v38.73,15.49
  Bottom 0.254: 39.27,14.96 41.91,12.32 41.91,8.26 44.45,5.71 44.45,3.81 J5.1 | 39.27,14.96 v38.73,15.49 | 39.27,14.96 39.1,15.59 v38.73,15.49 | 39.27,14.96 38.64,15.13 v38.73,15.49
PB13
  Top 0.254: IC1.52 34.45,24.38 36.7,24.38 39.24,21.84 39.24,16.51 43.05,12.7 43.81,12.7 44.45,12.06 44.45,8.26 45.72,6.99 J4.1
PB14
  Top 0.254: IC1.53 33.36,23.96 34.29,24.89 36.96,24.89 39.75,22.1 39.75,16.76 42.55,13.97 44.45,13.97 JP3.2
PB15
  Top 0.254: IC1.54 32.97,24.33 34.04,25.4 37.21,25.4 40.26,22.35 40.26,17.4 42.42,15.24 JP3.1
PC0
  Top 0.254: IC1.15 19.16,15.48 18.03,14.35 18.03,11.68 18.67,11.05 18.67,10.41 18.16,9.91 16.51,9.91 14.48,7.87 12.57,7.87 10.16,5.46 J4.15
PC1
  Top 0.254: IC1.16 18.54,14.13 18.54,12.06 19.56,11.05 19.56,10.54 18.41,9.4 16.76,9.4 14.73,7.37 13.08,7.37 11.43,5.71 11.43,3.81 J5.14
PC2
  Top 0.254: IC1.17 19.05,13.94 19.05,12.45 20.19,11.3 20.19,10.41 18.67,8.89 17.02,8.89 14.99,6.86 13.59,6.86 12.7,5.97 J4.14
PC3
  Top 0.254: IC1.18 19.56,13.74 19.56,12.7 20.7,11.56 20.7,10.16 18.92,8.38 17.27,8.38 15.24,6.35 14.61,6.35 13.97,5.71 13.97,3.81 J5.13
PC4
  Top 0.254: IC1.33 29.72,12.72 29.72,9.14 27.43,6.86 26.92,6.86 25.4,5.33 J4.9
PC5
  Top 0.254: IC1.34 30.23,12.92 30.23,8.89 27.69,6.35 27.3,6.35 26.67,5.71 26.67,3.81 J5.8
PC6
  Top 0.254: IC1.63 30.73,28.45 40.77,28.45 42.55,26.67 44.32,26.67 45.59,27.94 JP3.12
PC7
  Top 0.254: IC1.64 30.54,28.96 41.15,28.96 42.16,27.94 JP3.11
PC8
  Top 0.254: IC1.65 30.34,29.46 41.66,29.46 41.91,29.21 44.45,29.21 JP3.14
PC9
  Top 0.254: IC1.66 30.14,29.97 42.67,29.97 JP3.13
PC10
  Top 0.254: IC1.78 22.01,31.08 20.95,32.13 20.45,32.13 20.07,32.51 10.67,32.51 7.87,35.05 5.59,35.05 JP1.3
PC11
  Top 0.254: IC1.79 20.71,31.62 20.07,31.62 19.68,32 10.29,32 8,34.29 3.81,34.29 JP1.4
PD0
  Top 0.254: IC1.81 19.43,31.5 6.73,31.5 JP1.5
PD1
  Top 0.254: IC1.82 19.23,30.99 6.48,30.99 5.71,31.75 3.81,31.75 JP1.8
PD2  (via drill 0.6)
  Top 0.254: R10.1 18.67,35.94 19.05,35.94 v21.21,33.78 | v21.21,33.78 20.68,34.31 | v21.72,27.81 21.7,27.81 21.18,28.33 | 21.18,28.33 IC1.83 | 20.68,34.31 20.84,33.69 v21.21,33.78 | 20.68,34.31 21.3,34.15 v21.21,33.78 | 21.18,28.33 21.35,27.71 v21.72,27.81 | 21.18,28.33 21.81,28.18 v21.72,27.81
  Bottom 0.254: 21.21,33.03 v21.21,33.78 | v21.72,27.81 22.25,28.34 | 22.25,28.34 22.86,28.96 22.86,29.34 21.08,31.11 21.08,32.13 21.21,32.26 21.21,33.03 | JP1.7 19.05,30.48 21.19,28.34 | 21.19,28.34 v21.72,27.81 | 21.21,33.03 21.54,33.59 v21.21,33.78 | 21.21,33.03 20.88,33.59 v21.21,33.78 | 22.25,28.34 21.62,28.18 v21.72,27.81 | 22.25,28.34 22.08,27.72 v21.72,27.81 | 21.19,28.34 21.35,27.72 v21.72,27.81 | 21.19,28.34 21.81,28.18 v21.72,27.81
PD3
  Top 0.254: IC1.84 18.45,30.35 7.75,30.35 6.6,29.21 3.81,29.21 JP1.10
PD4
  Top 0.254: JP1.9 5.71,28.57 6.86,28.57 8.13,29.84 17.78,29.84 18.29,29.84 19.53,28.6 IC1.85
PD5
  Top 0.254: JP1.12 3.81,26.67 5.71,26.67 8.38,29.34 18.05,29.34 IC1.86
PD6
  Top 0.254: JP1.11 5.21,25.4 8.64,28.83 17.85,28.83 IC1.87
PD7
  Top 0.254: JP1.14 3.81,24.13 5.71,24.13 9.91,28.32 17.65,28.32 IC1.88
PD8
  Top 0.254: IC1.55 33.85,25.91 37.47,25.91 40.77,22.61 40.77,18.29 42.55,16.51 44.45,16.51 JP3.4
PD9
  Top 0.254: IC1.56 33.65,26.42 37.72,26.42 41.27,22.86 41.27,19.68 JP3.3
PD12  (via drill 0.6)
  Top 0.254: IC1.59 29.97,24.86 29.97,23.88 30.46,23.39 | v30.99,22.86 30.46,23.39 | 30.46,23.39 30.62,22.76 v30.99,22.86 | 30.46,23.39 31.08,23.22 v30.99,22.86
  Bottom 0.254: 31.52,23.39 v30.99,22.86 | 31.52,23.39 32.26,24.13 44.45,24.13 JP3.8 | 31.52,23.39 30.89,23.22 v30.99,22.86 | 31.52,23.39 31.35,22.76 v30.99,22.86
PD13  (via drill 0.6)
  Top 0.254: IC1.60 29.34,24.93 29.34,23.48 | v29.34,22.73 29.34,23.48 | 29.34,23.48 29.01,22.92 v29.34,22.73 | 29.34,23.48 29.66,22.92 v29.34,22.73
  Bottom 0.254: v29.34,22.73 29.87,22.2 | 29.87,22.2 30.23,21.84 34.04,21.84 35.81,23.62 41.91,23.62 42.67,22.86 JP3.7 | 29.87,22.2 29.7,22.83 v29.34,22.73 | 29.87,22.2 29.24,22.37 v29.34,22.73
PD14
  Top 0.254: IC1.61 31.13,27.43 37.85,27.43 41.15,24.13 44.45,24.13 JP3.10
PD15
  Top 0.254: IC1.62 30.93,27.94 40.26,27.94 42.8,25.4 JP3.9
PE0
  Top 0.254: JP1.19 5.08,15.88 6.35,17.14 6.35,17.78 8.51,19.94 8.51,21.97 11.68,25.15 14.46,25.15 IC1.97
PE2
  Top 0.254: 13.85,20.95 IC1.1 | 13.85,20.95 14.1,21.58 JP2.1 | 13.85,20.95 13.84,21.6 JP2.1 | 13.85,20.95 13.54,21.64 JP2.1
PE3
  Top 0.254: IC1.2 13.94,19.43 13.46,19.43 13.08,19.81 13.08,20.95 12.6,21.31 | JP7.1 12.6,21.31 | 12.6,21.31 12.43,21.94 JP7.1 | 12.6,21.31 11.97,21.48 JP7.1
PE4
  Top 0.254: IC1.3 14.14,18.92 13.08,18.92 12.37,19.63 | 12.37,19.63 12.19,19.94 JP6.1 | 12.37,19.63 12.44,20.28 JP6.1 | 12.37,19.63 11.84,20.01 JP6.1
PE5
  Top 0.254: IC1.4 14.34,18.41 12.45,18.41 11.18,19.68 11.18,21.46 11.01,21.63 | 11.01,21.63 10.79,21.84 JP9.1 | 11.01,21.63 10.56,22.1 JP9.1 | 11.01,21.63 10.38,21.48 JP9.1
PE6
  Top 0.254: IC1.5 14.54,17.91 12.19,17.91 10.5,19.6 | 10.5,19.6 10.29,19.81 JP8.1 | 10.5,19.6 10.65,20.23 JP8.1 | 10.5,19.6 10.03,20.05 JP8.1
PE7
  Top 0.254: IC1.38 31.75,14.22 31.75,6.48 30.48,5.21 J4.7
PE8
  Top 0.254: IC1.39 32.38,14.3 32.38,6.35 31.75,5.71 31.75,3.81 J5.6
PE9
  Top 0.254: IC1.40 33.02,14.37 J4.6
PE10
  Top 0.254: IC1.41 34.29,13.8 34.29,3.81 J5.5
PE11
  Top 0.254: IC1.42 34.8,14 34.8,5.84 J4.5
PE12
  Top 0.254: IC1.43 35.31,14.2 35.31,7.24 36.83,5.71 36.83,3.81 J5.4
PE13
  Top 0.254: IC1.44 35.81,14.4 35.81,7.87 38.1,5.59 J4.4
PE14
  Top 0.254: IC1.45 36.32,14.6 36.32,8.38 38.35,6.35 38.86,6.35 39.37,5.84 39.37,3.81 J5.3
PE15
  Top 0.254: IC1.46 36.83,14.8 36.83,9.14 39.62,6.35 40.01,6.35 40.64,5.71 J4.3

### Text on the board
tPlace: 5V | GND | 3V3 | 2 | 10 | 1 | 9 | GND | RESET | 3V3 | 5V | 11 | 10 | A12 | C11 | C10 | A9 | A8 | D0 | C8 | GND | C9 | D1 | D2 | C7 | C6 | D3 | D4 | 15 | 14 | D5 | D6 | 13 | 12 | D7 | B5 | 5 | 3 | 2 | 3V3 | GND | PE | B6 | B7 | 6 | 4 | D9 | D8 | B8 | B9 | B15 | B14 | GND | E0 | 1 | 0 | PWR | BOOT | 3V3 | STM32_CORE_V0_1 | Librae @ HITHD | C0 | C2 | A0 | A2 | A4 | A6 | C4 | B0 | E7 | E9 | 11 | 13 | 15 | 13 | B11 | GND | GND | C1 | C3 | A1 | A3 | A5 | A7 | C5 | B1 | E8 | 10 | 12 | 14 | B10 | 12
bPlace: 2010-9-10